# EAGLE schematic temp mon with eeprom rev 1 (EAGLE 7.3.0)
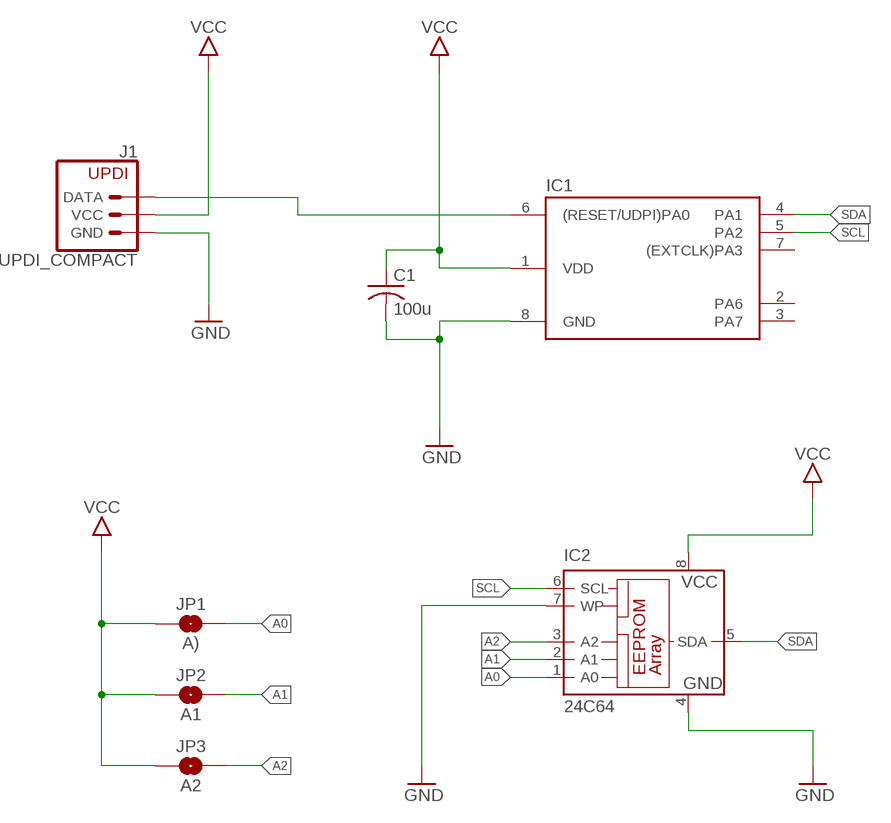
[diagram p0: schematic, sheet 1]

## Parts
C1  100u  C-USC0603  [C0603]
IC1  ATTINY212/412  [SOIC8N]
IC2  24C64  24C04CSN  [SO-08]
J1  UPDI_COMPACT  [UPDI_1X3]
JP1  A)  JUMPER-SMT_2_NO_SILK  [SMT-JUMPER_2_NO_SILK]
JP2  A1  JUMPER-SMT_2_NO_SILK  [SMT-JUMPER_2_NO_SILK]
JP3  A2  JUMPER-SMT_2_NO_SILK  [SMT-JUMPER_2_NO_SILK]

## Nets
A0: IC2.1(A0) JP1.2
A1: IC2.2(A1) JP2.2
A2: IC2.3(A2) JP3.2
GND: C1.2 IC1.8(GND) IC2.4(GND) IC2.7(WP) J1.2(GND)
N$1: IC1.6((RESET/UDPI)PA0) J1.3(DATA)
SCL: IC1.5(PA2) IC2.6(SCL)
SDA: IC1.4(PA1) IC2.5(SDA)
VCC: C1.1 IC1.1(VDD) IC2.8(VCC) J1.1(VCC) JP1.1 JP2.1 JP3.1
Unconnected: IC1.2(PA6) IC1.3(PA7) IC1.7((EXTCLK)PA3)

## Library data of the parts
C1 = rcl:C-US: CAPACITOR, American symbol
IC1 = bt_avr:ATTINY212/412: ATtiny412/212 The ATtiny212/412 are members of the tinyAVR ® 1-series of microcontrollers, using the AVR ® processor with hardware multiplier, running at up to 20 MHz, with 2/4 KB Flash, 128/256 bytes of SRAM, and 64/128 bytes of EEPROM in an 8-pin package. The tinyAVR ® 1-series uses the latest technologies with a flexible, low-power architecture including Event System and SleepWalking, accurate analog features, and Core Independent Peripherals. ATtiny212-412-DataSheet.pdf <https://ww1.microchip.com/downloads/en/DeviceDoc/ATtiny212-412-DataSheet-DS40001911B.pdf>
IC2 = microchip:24C*: Serial EEPROM 1 K/2 K/4 K; OC_FARNELL: unknown; OC_NEWARK: unknown
J1 = bt_avr:UPDI: AVR UPDI - Unified Program and Debug Interface UPDI is a Microchip proprietary interface for external programming and on-chip debugging of a device. It is a successor to the PDI two-wire physical interface, which is found on all AVR XMEGA devices. UPDI is a one-wire interface providing a bidirectional half-duplex asynchronous communication with the target device for purposes of programming and debugging. UPDI Physical Interface <https://onlinedocs.microchip.com/pr/GUID-DDB0017E-84E3-4E77-AAE9-7AC4290E5E8B-en-US-4/index.html?GUID-9B349315-2842-4189-B88C-49F4E1055D7F>
JP1-JP3 = SparkFun-Jumpers:JUMPER-SMT_2_NO: Normally open jumper This jumper has two pads in close proximity to each other. Apply solder to close the connection. Round pads are easier to solder for beginners, but are a lot larger. SparkFun Product that uses the round pads: SparkFun EL Sequencer <https://www.sparkfun.com/products/12781>